# Altium schematic sheet DAC.SchDoc: DAC
size 420 x 297 mm; CheckedBy: K.Belewicz; DrawnBy: G.Kasprowicz; SheetNumber: 3; SheetTotal: 5; ModifiedBy: -; CheckedDate: 12.06.2022; DivGrp: WUT ISE; Designer: G.Kasprowicz
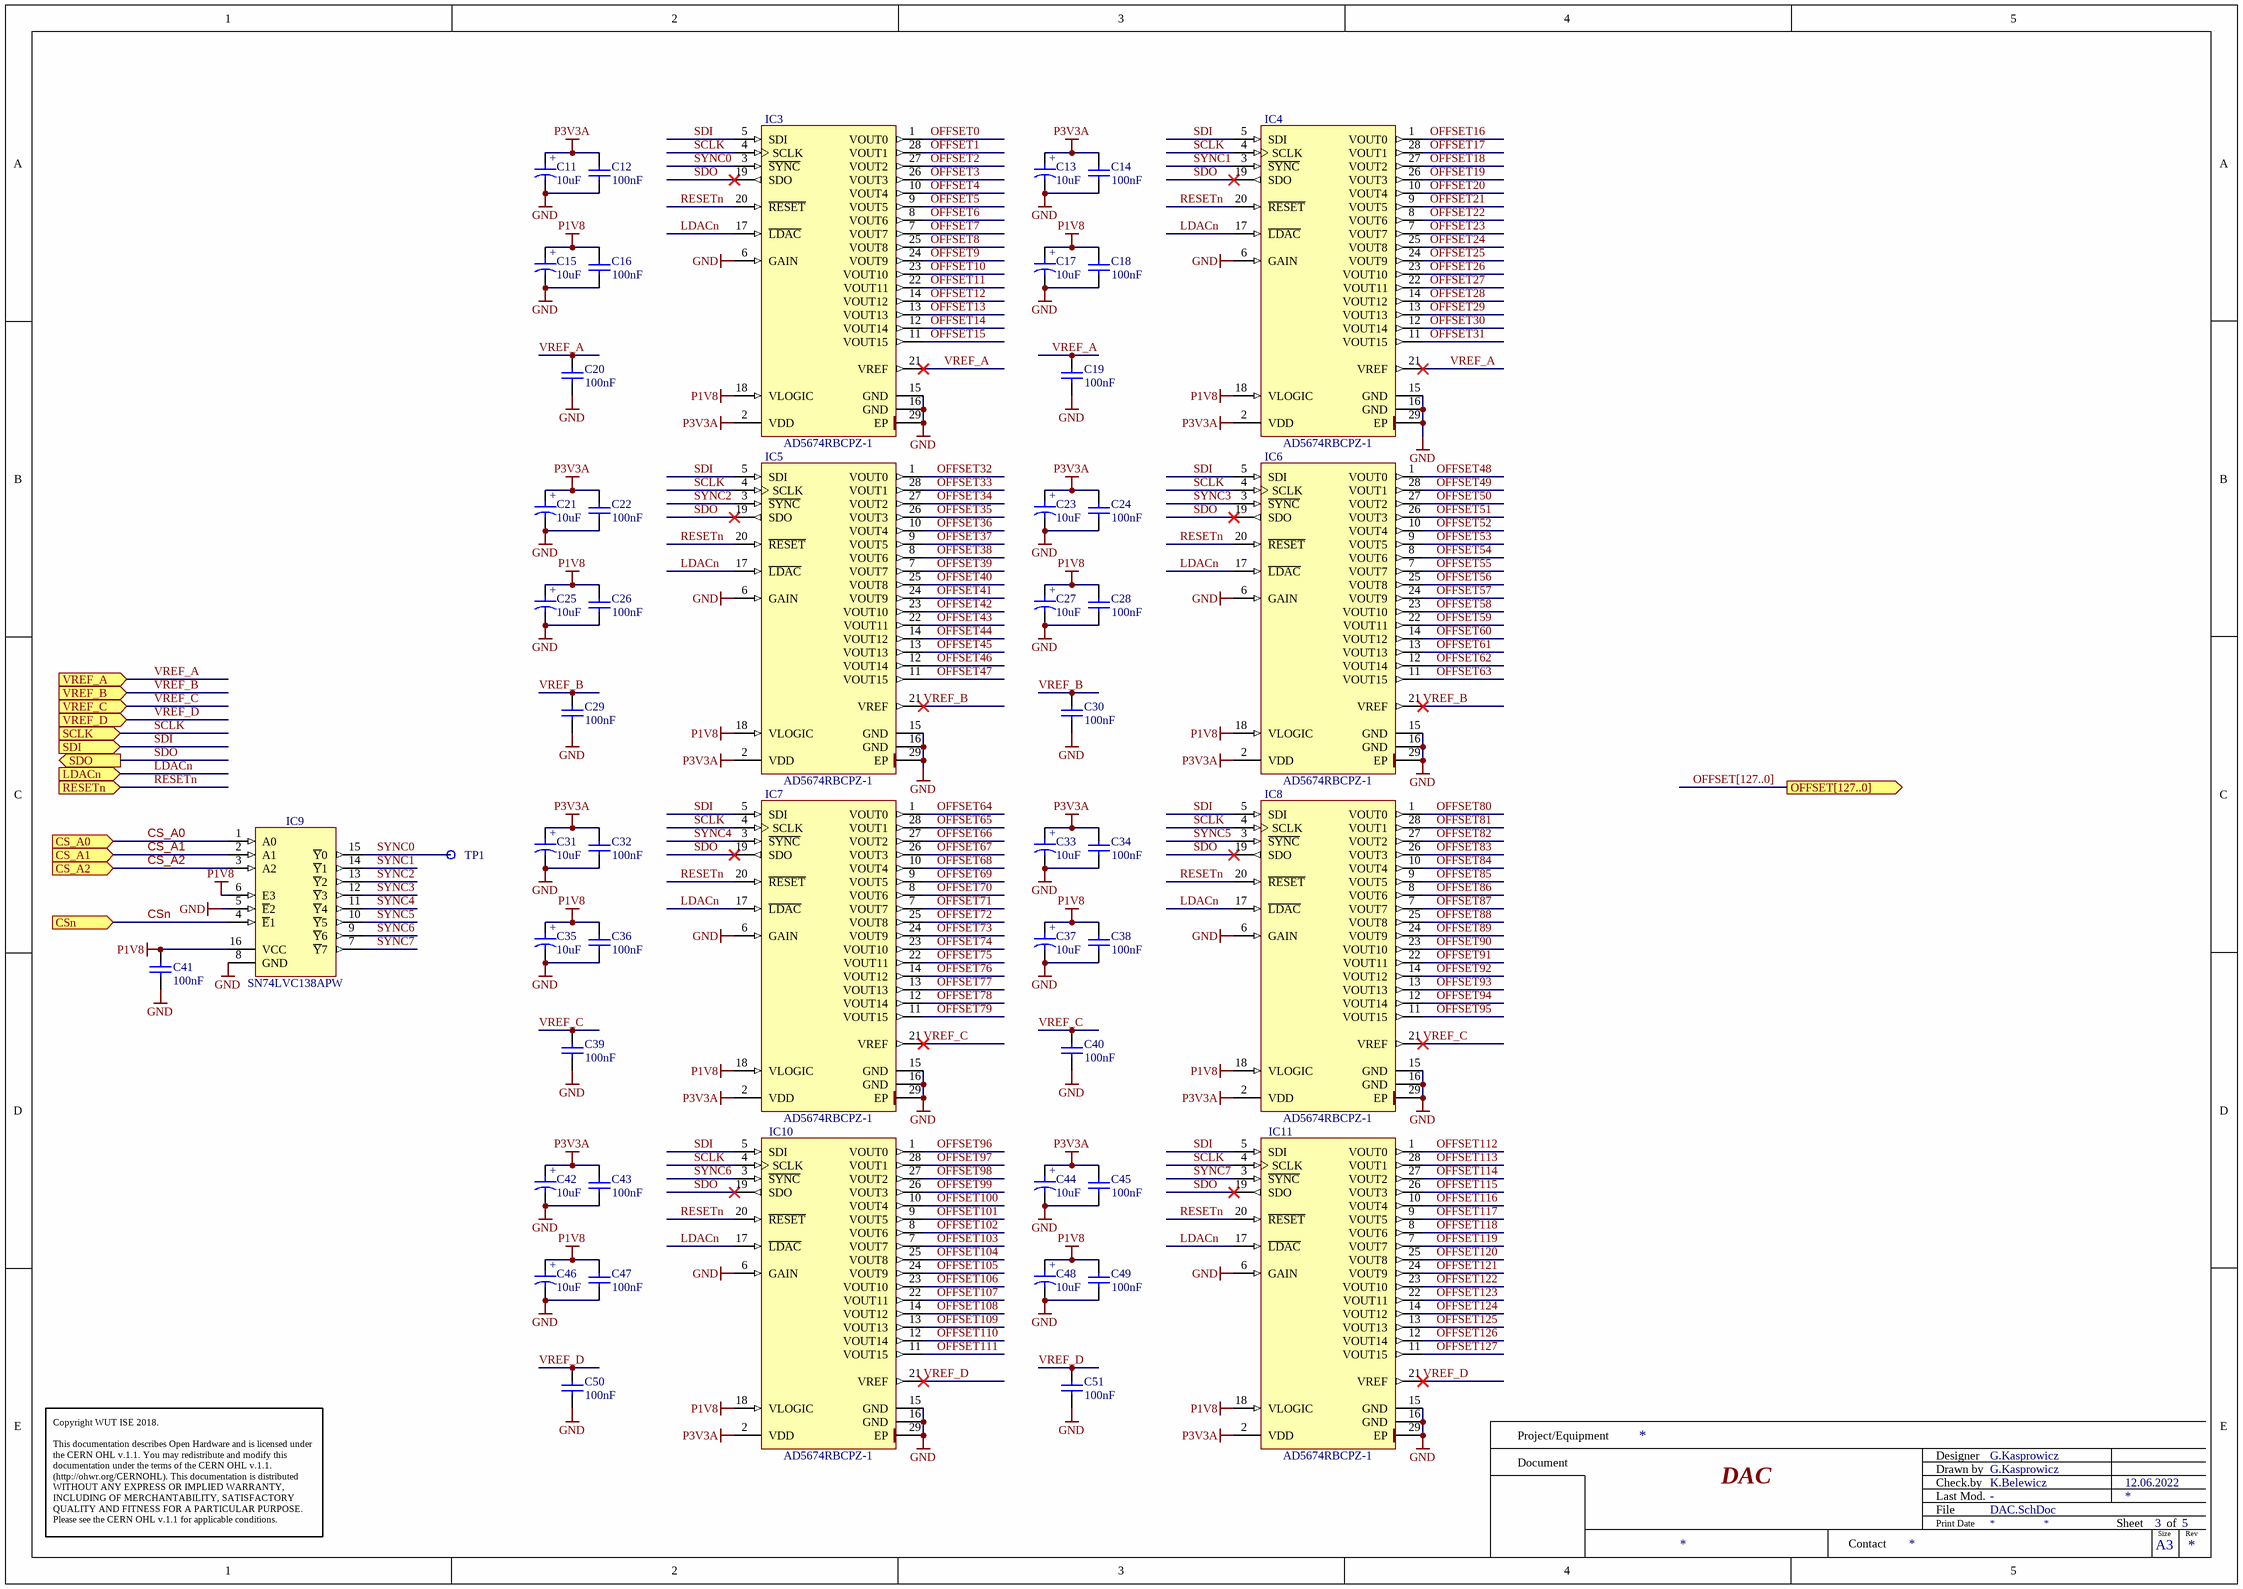
[diagram p0: DAC.SchDoc]

## Parts
C11  10uF  [CAPMP3216X180N]
C12  100nF  [CAPC1005X55N]
C13  10uF  [CAPMP3216X180N]
C14  100nF  [CAPC1005X55N]
C15  10uF  [CAPMP3216X180N]
C16  100nF  [CAPC1005X55N]
C17  10uF  [CAPMP3216X180N]
C18  100nF  [CAPC1005X55N]
C19  100nF  [CAPC1005X55N]
C20  100nF  [CAPC1005X55N]
C21  10uF  [CAPMP3216X180N]
C22  100nF  [CAPC1005X55N]
C23  10uF  [CAPMP3216X180N]
C24  100nF  [CAPC1005X55N]
C25  10uF  [CAPMP3216X180N]
C26  100nF  [CAPC1005X55N]
C27  10uF  [CAPMP3216X180N]
C28  100nF  [CAPC1005X55N]
C29  100nF  [CAPC1005X55N]
C30  100nF  [CAPC1005X55N]
C31  10uF  [CAPMP3216X180N]
C32  100nF  [CAPC1005X55N]
C33  10uF  [CAPMP3216X180N]
C34  100nF  [CAPC1005X55N]
C35  10uF  [CAPMP3216X180N]
C36  100nF  [CAPC1005X55N]
C37  10uF  [CAPMP3216X180N]
C38  100nF  [CAPC1005X55N]
C39  100nF  [CAPC1005X55N]
C40  100nF  [CAPC1005X55N]
C41  100nF  [CAPC1005X55N]
C42  10uF  [CAPMP3216X180N]
C43  100nF  [CAPC1005X55N]
C44  10uF  [CAPMP3216X180N]
C45  100nF  [CAPC1005X55N]
C46  10uF  [CAPMP3216X180N]
C47  100nF  [CAPC1005X55N]
C48  10uF  [CAPMP3216X180N]
C49  100nF  [CAPC1005X55N]
C50  100nF  [CAPC1005X55N]
C51  100nF  [CAPC1005X55N]
IC3  AD5674RBCPZ-1  [QFN40P400X400X100-29N-S270]
IC4  AD5674RBCPZ-1  [QFN40P400X400X100-29N-S270]
IC5  AD5674RBCPZ-1  [QFN40P400X400X100-29N-S270]
IC6  AD5674RBCPZ-1  [QFN40P400X400X100-29N-S270]
IC7  AD5674RBCPZ-1  [QFN40P400X400X100-29N-S270]
IC8  AD5674RBCPZ-1  [QFN40P400X400X100-29N-S270]
IC9  SN74LVC138APW  [SOP65P640X110-16N]
IC10  AD5674RBCPZ-1  [QFN40P400X400X100-29N-S270]
IC11  AD5674RBCPZ-1  [QFN40P400X400X100-29N-S270]
TP1  Test Point  [TPS127]  (value not drawn)

## Ports
CS_A0 (in), CS_A1 (in), CS_A2 (in), CSn (in), LDACn (in), OFFSET[127..0] (out), RESETn (in), SCLK (in), SDI (in), SDO (out), VREF_A (in), VREF_B (in), VREF_C (in), VREF_D (in)

## Nets
GND: C11.2 C12.1 C13.2 C14.1 C15.2 C16.1 C17.2 C18.1 C19.1 C20.1 C21.2 C22.1 C23.2 C24.1 C25.2 C26.1 C27.2 C28.1 C29.1 C30.1 C31.2 C32.1 C33.2 C34.1 C35.2 C36.1 C37.2 C38.1 C39.1 C40.1 C41.1 C42.2 C43.1 C44.2 C45.1 C46.2 C47.1 C48.2 C49.1 C50.1 C51.1 IC3.6(GAIN) IC3.15(GND) IC3.16(GND) IC3.29(EP) IC4.6(GAIN) IC4.15(GND) IC4.16(GND) IC4.29(EP) IC5.6(GAIN) IC5.15(GND) IC5.16(GND) IC5.29(EP) IC6.6(GAIN) IC6.15(GND) IC6.16(GND) IC6.29(EP) IC7.6(GAIN) IC7.15(GND) IC7.16(GND) IC7.29(EP) IC8.6(GAIN) IC8.15(GND) IC8.16(GND) IC8.29(EP) IC9.5(~{E}2) IC9.8(GND) IC10.6(GAIN) IC10.15(GND) IC10.16(GND) IC10.29(EP) IC11.6(GAIN) IC11.15(GND) IC11.16(GND) IC11.29(EP)
P1V8: C15.1 C16.2 C17.1 C18.2 C25.1 C26.2 C27.1 C28.2 C35.1 C36.2 C37.1 C38.2 C41.2 C46.1 C47.2 C48.1 C49.2 IC3.18(VLOGIC) IC4.18(VLOGIC) IC5.18(VLOGIC) IC6.18(VLOGIC) IC7.18(VLOGIC) IC8.18(VLOGIC) IC9.6(E3) IC9.16(VCC) IC10.18(VLOGIC) IC11.18(VLOGIC)
P3V3A: C11.1 C12.2 C13.1 C14.2 C21.1 C22.2 C23.1 C24.2 C31.1 C32.2 C33.1 C34.2 C42.1 C43.2 C44.1 C45.2 IC3.2(VDD) IC4.2(VDD) IC5.2(VDD) IC6.2(VDD) IC7.2(VDD) IC8.2(VDD) IC10.2(VDD) IC11.2(VDD)
CS_A0: IC9.1(A0) ; port CS_A0
CS_A1: IC9.2(A1) ; port CS_A1
CS_A2: IC9.3(A2) ; port CS_A2
CSn: IC9.4(~{E}1) ; port CSn
LDACn: IC3.17(~{LDAC}) IC4.17(~{LDAC}) IC5.17(~{LDAC}) IC6.17(~{LDAC}) IC7.17(~{LDAC}) IC8.17(~{LDAC}) IC10.17(~{LDAC}) IC11.17(~{LDAC}) ; port LDACn
OFFSET0: IC3.1(VOUT0)
OFFSET1: IC3.28(VOUT1)
OFFSET2: IC3.27(VOUT2)
OFFSET3: IC3.26(VOUT3)
OFFSET4: IC3.10(VOUT4)
OFFSET5: IC3.9(VOUT5)
OFFSET6: IC3.8(VOUT6)
OFFSET7: IC3.7(VOUT7)
OFFSET8: IC3.25(VOUT8)
OFFSET9: IC3.24(VOUT9)
OFFSET10: IC3.23(VOUT10)
OFFSET11: IC3.22(VOUT11)
OFFSET12: IC3.14(VOUT12)
OFFSET13: IC3.13(VOUT13)
OFFSET14: IC3.12(VOUT14)
OFFSET15: IC3.11(VOUT15)
OFFSET16: IC4.1(VOUT0)
OFFSET17: IC4.28(VOUT1)
OFFSET18: IC4.27(VOUT2)
OFFSET19: IC4.26(VOUT3)
OFFSET20: IC4.10(VOUT4)
OFFSET21: IC4.9(VOUT5)
OFFSET22: IC4.8(VOUT6)
OFFSET23: IC4.7(VOUT7)
OFFSET24: IC4.25(VOUT8)
OFFSET25: IC4.24(VOUT9)
OFFSET26: IC4.23(VOUT10)
OFFSET27: IC4.22(VOUT11)
OFFSET28: IC4.14(VOUT12)
OFFSET29: IC4.13(VOUT13)
OFFSET30: IC4.12(VOUT14)
OFFSET31: IC4.11(VOUT15)
OFFSET32: IC5.1(VOUT0)
OFFSET33: IC5.28(VOUT1)
OFFSET34: IC5.27(VOUT2)
OFFSET35: IC5.26(VOUT3)
OFFSET36: IC5.10(VOUT4)
OFFSET37: IC5.9(VOUT5)
OFFSET38: IC5.8(VOUT6)
OFFSET39: IC5.7(VOUT7)
OFFSET40: IC5.25(VOUT8)
OFFSET41: IC5.24(VOUT9)
OFFSET42: IC5.23(VOUT10)
OFFSET43: IC5.22(VOUT11)
OFFSET44: IC5.14(VOUT12)
OFFSET45: IC5.13(VOUT13)
OFFSET46: IC5.12(VOUT14)
OFFSET47: IC5.11(VOUT15)
OFFSET48: IC6.1(VOUT0)
OFFSET49: IC6.28(VOUT1)
OFFSET50: IC6.27(VOUT2)
OFFSET51: IC6.26(VOUT3)
OFFSET52: IC6.10(VOUT4)
OFFSET53: IC6.9(VOUT5)
OFFSET54: IC6.8(VOUT6)
OFFSET55: IC6.7(VOUT7)
OFFSET56: IC6.25(VOUT8)
OFFSET57: IC6.24(VOUT9)
OFFSET58: IC6.23(VOUT10)
OFFSET59: IC6.22(VOUT11)
OFFSET60: IC6.14(VOUT12)
OFFSET61: IC6.13(VOUT13)
OFFSET62: IC6.12(VOUT14)
OFFSET63: IC6.11(VOUT15)
OFFSET64: IC7.1(VOUT0)
OFFSET65: IC7.28(VOUT1)
OFFSET66: IC7.27(VOUT2)
OFFSET67: IC7.26(VOUT3)
OFFSET68: IC7.10(VOUT4)
OFFSET69: IC7.9(VOUT5)
OFFSET70: IC7.8(VOUT6)
OFFSET71: IC7.7(VOUT7)
OFFSET72: IC7.25(VOUT8)
OFFSET73: IC7.24(VOUT9)
OFFSET74: IC7.23(VOUT10)
OFFSET75: IC7.22(VOUT11)
OFFSET76: IC7.14(VOUT12)
OFFSET77: IC7.13(VOUT13)
OFFSET78: IC7.12(VOUT14)
OFFSET79: IC7.11(VOUT15)
OFFSET80: IC8.1(VOUT0)
OFFSET81: IC8.28(VOUT1)
OFFSET82: IC8.27(VOUT2)
OFFSET83: IC8.26(VOUT3)
OFFSET84: IC8.10(VOUT4)
OFFSET85: IC8.9(VOUT5)
OFFSET86: IC8.8(VOUT6)
OFFSET87: IC8.7(VOUT7)
OFFSET88: IC8.25(VOUT8)
OFFSET89: IC8.24(VOUT9)
OFFSET90: IC8.23(VOUT10)
OFFSET91: IC8.22(VOUT11)
OFFSET92: IC8.14(VOUT12)
OFFSET93: IC8.13(VOUT13)
OFFSET94: IC8.12(VOUT14)
OFFSET95: IC8.11(VOUT15)
OFFSET96: IC10.1(VOUT0)
OFFSET97: IC10.28(VOUT1)
OFFSET98: IC10.27(VOUT2)
OFFSET99: IC10.26(VOUT3)
OFFSET100: IC10.10(VOUT4)
OFFSET101: IC10.9(VOUT5)
OFFSET102: IC10.8(VOUT6)
OFFSET103: IC10.7(VOUT7)
OFFSET104: IC10.25(VOUT8)
OFFSET105: IC10.24(VOUT9)
OFFSET106: IC10.23(VOUT10)
OFFSET107: IC10.22(VOUT11)
OFFSET108: IC10.14(VOUT12)
OFFSET109: IC10.13(VOUT13)
OFFSET110: IC10.12(VOUT14)
OFFSET111: IC10.11(VOUT15)
OFFSET112: IC11.1(VOUT0)
OFFSET113: IC11.28(VOUT1)
OFFSET114: IC11.27(VOUT2)
OFFSET115: IC11.26(VOUT3)
OFFSET116: IC11.10(VOUT4)
OFFSET117: IC11.9(VOUT5)
OFFSET118: IC11.8(VOUT6)
OFFSET119: IC11.7(VOUT7)
OFFSET120: IC11.25(VOUT8)
OFFSET121: IC11.24(VOUT9)
OFFSET122: IC11.23(VOUT10)
OFFSET123: IC11.22(VOUT11)
OFFSET124: IC11.14(VOUT12)
OFFSET125: IC11.13(VOUT13)
OFFSET126: IC11.12(VOUT14)
OFFSET127: IC11.11(VOUT15)
RESETn: IC3.20(~{RESET}) IC4.20(~{RESET}) IC5.20(~{RESET}) IC6.20(~{RESET}) IC7.20(~{RESET}) IC8.20(~{RESET}) IC10.20(~{RESET}) IC11.20(~{RESET}) ; port RESETn
SCLK: IC3.4(SCLK) IC4.4(SCLK) IC5.4(SCLK) IC6.4(SCLK) IC7.4(SCLK) IC8.4(SCLK) IC10.4(SCLK) IC11.4(SCLK) ; port SCLK
SDI: IC3.5(SDI) IC4.5(SDI) IC5.5(SDI) IC6.5(SDI) IC7.5(SDI) IC8.5(SDI) IC10.5(SDI) IC11.5(SDI) ; port SDI
SDO: IC3.19(SDO) IC4.19(SDO) IC5.19(SDO) IC6.19(SDO) IC7.19(SDO) IC8.19(SDO) IC10.19(SDO) IC11.19(SDO) ; port SDO
SYNC0: IC3.3(~{SYNC}) IC9.15(~{Y}0) TP1.1
SYNC1: IC4.3(~{SYNC}) IC9.14(~{Y}1)
SYNC2: IC5.3(~{SYNC}) IC9.13(~{Y}2)
SYNC3: IC6.3(~{SYNC}) IC9.12(~{Y}3)
SYNC4: IC7.3(~{SYNC}) IC9.11(~{Y}4)
SYNC5: IC8.3(~{SYNC}) IC9.10(~{Y}5)
SYNC6: IC9.9(~{Y}6) IC10.3(~{SYNC})
SYNC7: IC9.7(~{Y}7) IC11.3(~{SYNC})
VREF_A: C19.2 C20.2 IC3.21(VREF) IC4.21(VREF) ; port VREF_A
VREF_B: C29.2 C30.2 IC5.21(VREF) IC6.21(VREF) ; port VREF_B
VREF_C: C39.2 C40.2 IC7.21(VREF) IC8.21(VREF) ; port VREF_C
VREF_D: C50.2 C51.2 IC10.21(VREF) IC11.21(VREF) ; port VREF_D

## Buses and harness runs
bus OFFSET[127..0] = port OFFSET[127..0]

## Notes on the sheet
- Project/Equipment
- Document
- Designer
- Drawn by
- Check.by
- Copyright WUT ISE 2018.
  This documentation describes Open Hardware and is licensed under the CERN OHL v.1.1. You may redistribute and modify this documentation under the terms of the CERN OHL v.1.1. (http://ohwr.org/CERNOHL). This documentation is distributed WITHOUT ANY EXPRESS OR IMPLIED WARRANTY, INCLUDING OF MERCHANTABILITY, SATISFACTORY QUALITY AND FITNESS FOR A PARTICULAR PURPOSE. Please see the CERN OHL v.1.1 for applicable conditions.
- Contact
- File
- Last Mod.
- Print Date
- Sheet
- Size
- A3
- of
- Rev
- (in symbol CTE3216-18_10UF_16V_20%_AVX_TCJ) +

## Library data of the parts
C11 C13 C15 C17 C21 C23 C25 C27 C31 C33 C35 C37 C42 C44 C46 C48 = CTE3216-18_10UF_16V_20%_AVX_TCJ: Polarised capacitor; Part Description: ESR 0R200 Tantalum Solid Electrolytic Chip Capacitor with Conductive Polymer Electrode; Manufacturer: AVX; Manufacturer Part Number: TCJA106M016R0200; Voltage: 16V; Tolerance: ±20%; Part Number: CTE3216-18_10UF_16V_20%_AVX_TCJ; Component Kind: Standard; Component Type: Standard; Pin Count: 2; Value: 10uF; Status: Preferred; Case: A; Mounted: Yes; Socket: No; SMD: Yes; Sense: No; ComponentHeight: 1.8mm; HelpURL: \\cern.ch\dfs\Applications\Altium\Datasheets\CTE_AVX_TCJ.pdf; Author: CERN DEM JLC; CreateDate: 29.03.2012; LatestRevisionDate: 29.03.2012
C12 C14 C16 C18-C20 C22 C24 C26 C28-C30 C32 C34 C36 C38-C40 C43 C45 C47 C49-C51 = CC0402_100NF_6.3V_10%_X7R: Non-polarised capacitor; Part Description: SMD Multilayer Chip Ceramic Capacitor; Manufacturer: GENERIC; Manufacturer1 Part Number: GRM155R70J104KA01D; Voltage: 6.3V; TC: X7R; Tolerance: ±10%; Part Number: CC0402_100NF_6.3V_10%_X7R; Component Kind: Standard; Component Type: Standard; Pin Count: 2; Value: 100nF; Status: Not Recommended; Manufacturer Part Number: CC0402_100NF_6.3V_10%_X7R; Case: 0402; Mounted: Yes; Socket: No; SMD: Yes; Sense: No; Manufacturer1 Example: MURATA; Manufacturer1 ComponentHeight: 0.55mm; HelpURL: \\cern.ch\dfs\Applications\Altium\Datasheets\CC0402_X7R_MURATA_GRM.pdf; Author: CERN DEM BC; CreateDate: 02.11.2015; LatestRevisionDate: 02.11.2015
C41 = CC0402_100NF_16V_10%_X5R: Non-polarised capacitor; Part Description: SMD Multilayer Chip Ceramic Capacitor; Manufacturer: GENERIC; Manufacturer1 Part Number: GRM155R61C104KA88D; Voltage: 16V; TC: X5R; Tolerance: ±10%; Part Number: CC0402_100NF_16V_10%_X5R; Component Kind: Standard; Component Type: Standard; Pin Count: 2; Value: 100nF; Status: None; Manufacturer Part Number: CC0402_100NF_16V_10%_X5R; Case: 0402; Mounted: Yes; Socket: No; SMD: Yes; Sense: No; Manufacturer1 Example: MURATA; Manufacturer1 ComponentHeight: 0.55mm; HelpURL: \\cern.ch\dfs\Applications\Altium\Datasheets\CC0402_X5R_MURATA_GRM.pdf; Author: CERN DEM JLC; CreateDate: 10.12.2013; LatestRevisionDate: 10.12.2013
IC3-IC8 IC10 IC11 = AD5674RBCPZ-1: 12-Bit nanoDAC+ with 2 ppm/°C Voltage Reference Temperature Coefficient, SPI Interface; Manufacturer: ANALOG DEVICES; PressFit: No; Bonding: No; Part Number: AD5674RBCPZ-1; Component Kind: Standard; Component Type: Standard; Device: AD5674RBCPZ-1; PackageDescription: QFN, 0.40mm Pitch, Square; 28 Pin, 4.00mm L X 4.00mm W X 1.00mm H body (w/Thermal Tab 2.70 X 2.70mm), IPC Medium Density; Part Description: 12-Bit nanoDAC+ with 2 ppm/°C Voltage Reference Temperature Coefficient, SPI Interface; Manufacturer Part Number: AD5674RBCPZ-1; Pin Count: 28; Case: QFN28; Mounted: Yes; Socket: No; SMD: Yes; Sense: No; ComponentHeight: 1.0mm; Author: CERN DEM HF; HelpURL: \\cern.ch\dfs\Applications\Altium\Datasheets\AD5674RBCPZ-1.pdf; CreateDate: 19.04.2022; LatestRevisionDate: 19.04.2022
IC9 = SN74LVC138APW: 3-Line to 8-Line Decoder/Demultiplexer; Part Description: 3-Line to 8-Line Decoder/Demultiplexer, Inverting; Manufacturer: Texas Instruments; PressFit: No; Bonding: No; Part Number: SN74LVC138APW; Component Kind: Standard; Component Type: Standard; Device: SN74LVC138APW; PackageDescription: SOP, 0.65mm pitch; 16 pin, 4.40mm W X 5.00mm L X 1.10mm H body IPC Medium Density; Manufacturer Part Number: SN74LVC138APW; Pin Count: 16; Case: TSSOP16; Mounted: Yes; Socket: No; SMD: Yes; Sense: No; ComponentHeight: 1.1mm; Author: GK; HelpURL: \\cern.ch\dfs\Applications\Altium\Datasheets\74HC138PW.pdf; CreateDate: 09/06/2015; LatestRevisionDate: 09/06/2015
TP1 = SMD_PAD_1.27X1.27MM: Part Description: 1.27mm x 1.27mm PCB Copper Area (SMD Test Point); Mounted: No; Part Number: SMD_PAD_1.27X1.27MM; Component Kind: Standard (No BOM); Component Type: Standard (No BOM); Pin Count: 1; Family: Test Point; Socket: No; SMD: Yes; Sense: No; Status: None; ComponentHeight: 0mm; HelpURL: Undefined; Author: CERN DEM JLC; CreateDate: 12.01.2008; LatestRevisionDate: 12.01.2008; PackageDescription: 1.27mm x 1.27mm PCB Copper Area (SMD Test Point)